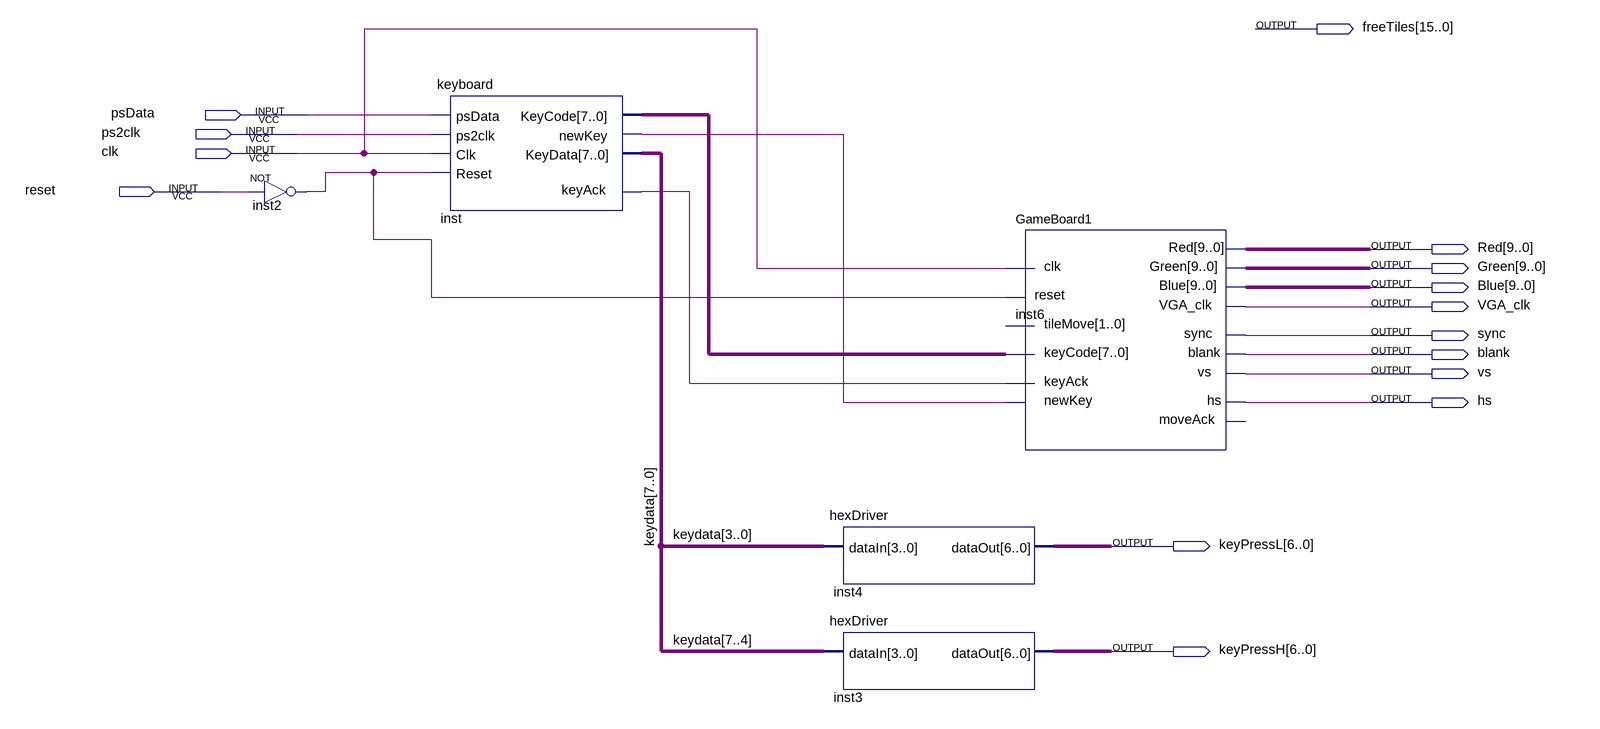
[diagram p0: schematic sheet]
// Quartus schematic 2048.bdf as structural Verilog: 5 symbols, 15 pins
module \2048  (
  input  psData,
  input  ps2clk,
  input  clk,
  input  reset,
  output [15:0] freeTiles,
  output [9:0] Red,
  output [9:0] Green,
  output [9:0] Blue,
  output VGA_clk,
  output sync,
  output blank,
  output vs,
  output hs,
  output [6:0] keyPressL,
  output [6:0] keyPressH
);

  wire inst2_out, inst6_keyack, inst_newkey;
  wire [7:0] inst_keycode, keydata;

  not inst2 (inst2_out, reset);
  keyboard inst (
    .keyAck(inst6_keyack), .psData(psData), .ps2clk(ps2clk), .Clk(clk), .Reset(inst2_out),
    .KeyCode(inst_keycode), .newKey(inst_newkey), .KeyData(keydata));
  hexDriver inst4 (.dataIn(keydata[3:0]), .dataOut(keyPressL));
  hexDriver inst3 (.dataIn(keydata[7:4]), .dataOut(keyPressH));
  GameBoard1 inst6 (
    .clk(clk), .reset(inst2_out), .newKey(inst_newkey), .keyCode(inst_keycode), .Red(Red), .Green(Green),
    .Blue(Blue), .VGA_clk(VGA_clk), .sync(sync), .keyAck(inst6_keyack), .blank(blank), .vs(vs), .hs(hs));  // open: tileMove, moveAck
endmodule
